# Altium schematic sheet touch.SchDoc
size A4; SheetNumber: 2; SheetTotal: 3
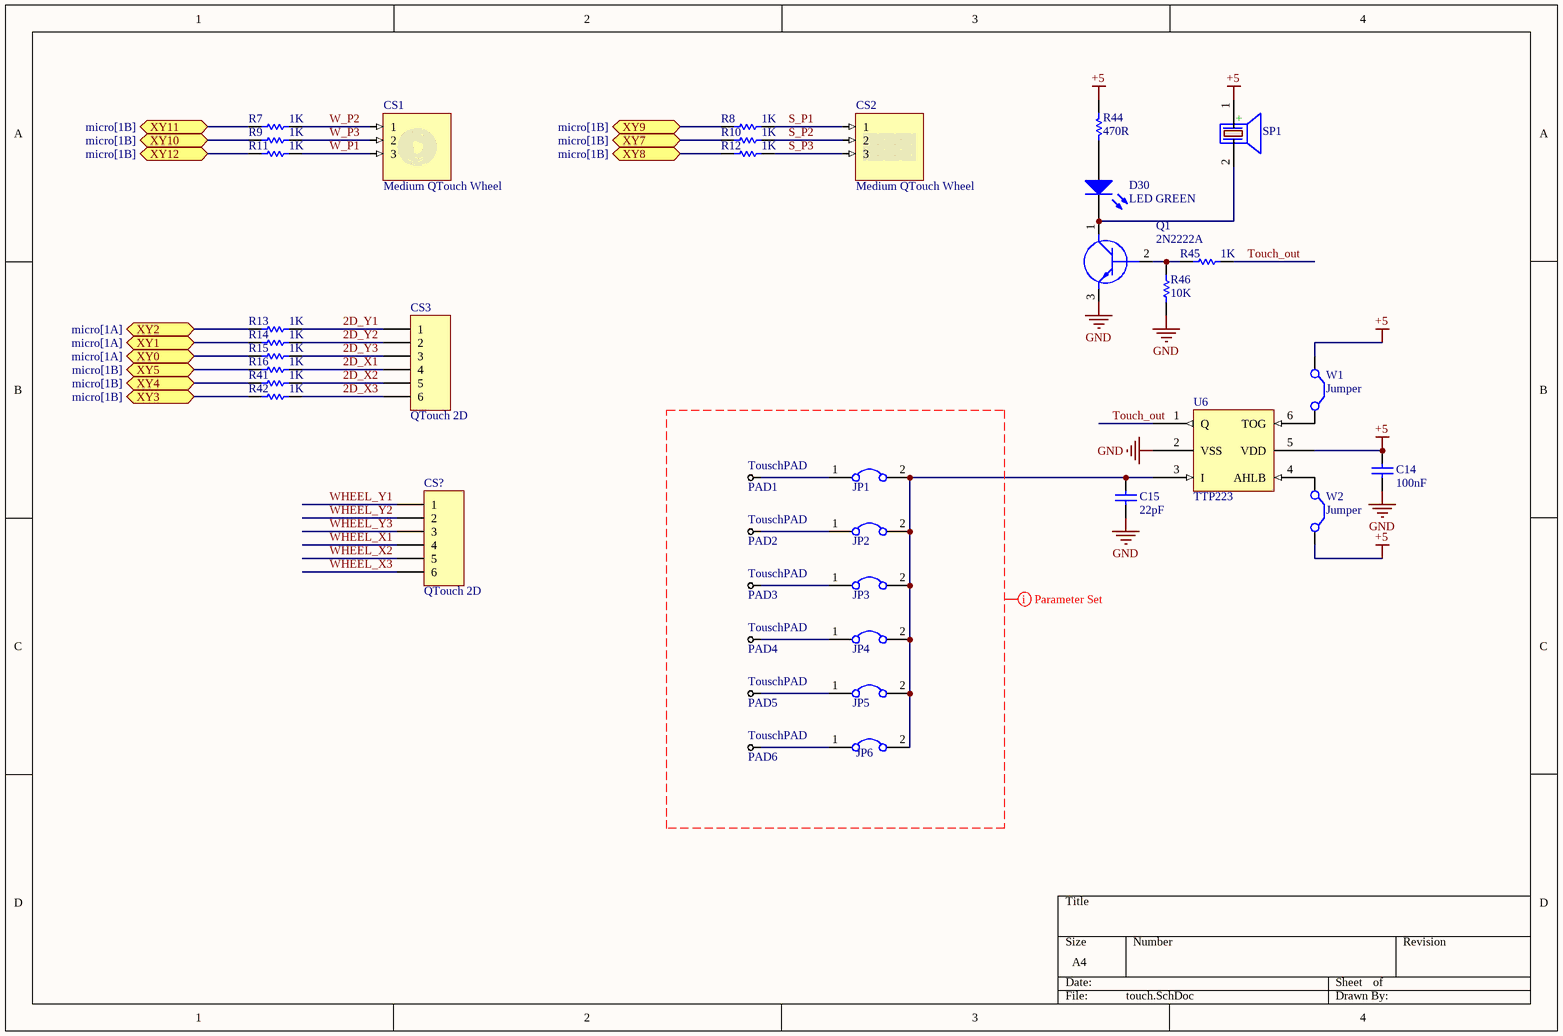
[diagram p0: touch.SchDoc]

## Parts
C14  value 100nF  [CAP0805]  (hidden comment: cap 100nF)
C15  value 22pF  [CAP0805]  (hidden comment: cap 22pF)
CS1  Medium QTouch Wheel  (no BOM)
CS2  Medium QTouch Wheel  (no BOM)
CS3  QTouch 2D  [2D_touch surface]
CS?  QTouch 2D  [wheel]
D30  LED GREEN  [LED_0805 G]
JP1  Jumper  [Jumper Small - 2.54 - GRAY]  (value not drawn)
JP2  Jumper  [Jumper Small - 2.54 - GRAY]  (value not drawn)
JP3  Jumper  [Jumper Small - 2.54 - GRAY]  (value not drawn)
JP4  Jumper  [Jumper Small - 2.54 - GRAY]  (value not drawn)
JP5  Jumper  [Jumper Small - 2.54 - GRAY]  (value not drawn)
JP6  Jumper  [Jumper Small - 2.54 - GRAY]  (value not drawn)
PAD1  TouschPAD  [touchpad1]  (no BOM)
PAD2  TouschPAD  [touchpad2]  (no BOM)
PAD3  TouschPAD  [touchpad3]  (no BOM)
PAD4  TouschPAD  [touchpad4]  (no BOM)
PAD5  TouschPAD  [touchpad5]  (no BOM)
PAD6  TouschPAD  [touchpad6]  (no BOM)
Q1  2N2222A  [SOT23_M]
R7  1K  [RES 0805 (2012X06L)]
R8  1K  [RES 0805 (2012X06L)]
R9  1K  [RES 0805 (2012X06L)]
R10  1K  [RES 0805 (2012X06L)]
R11  1K  [RES 0805 (2012X06L)]
R12  1K  [RES 0805 (2012X06L)]
R13  1K  [RES 0805 (2012X06L)]
R14  1K  [RES 0805 (2012X06L)]
R15  1K  [RES 0805 (2012X06L)]
R16  1K  [RES 0805 (2012X06L)]
R41  1K  [RES 0805 (2012X06L)]
R42  1K  [RES 0805 (2012X06L)]
R44  value 470R  [RES0805]  (hidden comment: Res 470R)
R45  1K  [RES 0805 (2012X06L)]
R46  10K  [RES 0805 (2012X06L)]
SP1  BUZZER  [BUZZER 7.62mm DC]  (value not drawn)
U6  TTP223  [SOT23-6_L]
W1  Jumper  [JUMPER]  (no BOM)
W2  Jumper  [JUMPER]  (no BOM)

## Ports
XY0 (bidir, see micro[1A]), XY1 (bidir, see micro[1A]), XY2 (bidir, see micro[1A]), XY3 (bidir, see micro[1B]), XY4 (bidir, see micro[1B]), XY5 (bidir, see micro[1B]), XY7 (bidir, see micro[1B]), XY8 (bidir, see micro[1B]), XY9 (bidir, see micro[1B]), XY10 (bidir, see micro[1B]), XY11 (bidir, see micro[1B]), XY12 (bidir, see micro[1B])

## Nets
+5: C14.2 R44.1 SP1.1(+) U6.5(VDD) W1.1(C1) W2.2(C2)
GND: C14.1 C15.1 Q1.3(E) R46.2 U6.2(VSS)
2D_X1: CS3.4 R16.1
2D_X2: CS3.5 R41.1
2D_X3: CS3.6 R42.1
2D_Y1: CS3.1 R13.1
2D_Y2: CS3.2 R14.1
2D_Y3: CS3.3 R15.1
S_P1: CS2.1 R8.1
S_P2: CS2.2 R10.1
S_P3: CS2.3 R12.1
Touch_out: R45.1 U6.1(Q)
W_P1: CS1.3 R11.1
W_P2: CS1.1 R7.1
W_P3: CS1.2 R9.1
WHEEL_X1: CS?.4
WHEEL_X2: CS?.5
WHEEL_X3: CS?.6
WHEEL_Y1: CS?.1
WHEEL_Y2: CS?.2
WHEEL_Y3: CS?.3
XY0: R15.2 ; port XY0
XY1: R14.2 ; port XY1
XY2: R13.2 ; port XY2
XY3: R42.2 ; port XY3
XY4: R41.2 ; port XY4
XY5: R16.2 ; port XY5
XY7: R10.2 ; port XY7
XY8: R12.2 ; port XY8
XY9: R8.2 ; port XY9
XY10: R9.2 ; port XY10
XY11: R7.2 ; port XY11
XY12: R11.2 ; port XY12
NetC15_2: C15.2 JP1.2 JP2.2 JP3.2 JP4.2 JP5.2 JP6.2 U6.3(I)
NetD30_1: D30.1(A) R44.2
NetD30_2: D30.2(K) Q1.1(C) SP1.2(-)
NetJP1_1: JP1.1 PAD1.1(T)
NetJP2_1: JP2.1 PAD2.1(T)
NetJP3_1: JP3.1 PAD3.1(T)
NetJP4_1: JP4.1 PAD4.1(T)
NetJP5_1: JP5.1 PAD5.1(T)
NetJP6_1: JP6.1 PAD6.1(T)
NetQ1_2: Q1.2(B) R45.2 R46.1
NetU6_4: U6.4(AHLB) W2.1(C1)
NetU6_6: U6.6(TOG) W1.2(C2)

## Layout directives
net class touch_pads: (no net found under the mark)

## Library data of the parts
C14 C15 = Cap ceramic: CAP seramic
CS1 = MediumQTouchWheel: ConfiguratorName: ATMEL_TOUCH; ConfigurationParameters: {}__sensorid[8]{}odiameter[60]{}idiameter[30]{}gapthickness[0.3]{}
CS2 = MediumQTouchWheel: ConfiguratorName: ATMEL_TOUCH; ConfigurationParameters: {}__sensorid[4]{}width[50]{}height[12]{}gapthickness[0.3]{}
CS3 CS? = Header 6: 3 by 3 2D touch surface; LatestRevisionDate: 17-Jul-2002; LatestRevisionNote: Re-released for DXP Platform.; Publisher: Altium Limited
D30 = LED0: LED SMD 0805 GREEN; Published: 8-Jun-2000; LatestRevisionDate: 08-Jul-2005; LatestRevisionNote: Mech Layer 1 removed.; PackageReference: LED-0; Publisher: Altium Limited; PackageDescription: LED; 2 Leads
JP1-JP6 = Jumper: Company: E.P.I.L; Defualt State: Close; Design Date: 2011/11/02
PAD1-PAD6 = Test Point
Q1 = 2N2222A: Transistor BJT NPN SMD; Manufacturer_Name: Foshan Blue Rocket Elec; Datasheet Link: https://datasheet.lcsc.com/szlcsc/1901291437_Foshan-Blue-Rocket-Elec-2N2222A_C358533.pdf; Height: 4.7mm; Manufacturer_Part_Number: 2N2222A
R7-R16 R41 R42 R44-R46 = Res1: Resistor; Published: 8-Jun-2000; LatestRevisionDate: 17-Jul-2002; LatestRevisionNote: Re-released for DXP Platform.; PackageReference: AXIAL-0.3; Publisher: Altium Limited; PackageDescription: Axial Device, Thru-Hole; 2 Leads; 0.3 in Pin Spacing
  R7-R16 R41 R42 R45: Value: 1K
  R46: Value: 10K
SP1 = PIEZO BUZZER: PIEZO BUZZER 5VOLTS; Designer: Abbas Basereh; Comment_1: SPEAKER AND BEEP; Design Date: 1395/11/14; ComponentLink2Description: Reference; PackageDescription: THD; Publisher: Abbas Basereh; Mounting Technology: THD; Pin Count: 2; Status: Unreleased
U6 = ttp223b: capacitive touch IC
W1 W2 = Jumper: Jumper Wire; Published: 24-Mar-1999; LatestRevisionDate: 17-Jul-2002; LatestRevisionNote: Re-released for DXP Platform.; PackageReference: RAD-0.2; Publisher: Altium Limited; PackageDescription: Radial Cap, Thru-Hole; 2 Leads; 0.2 in Pin Spacing